# EAGLE schematic ClassD-v3 (EAGLE 7.6.0)
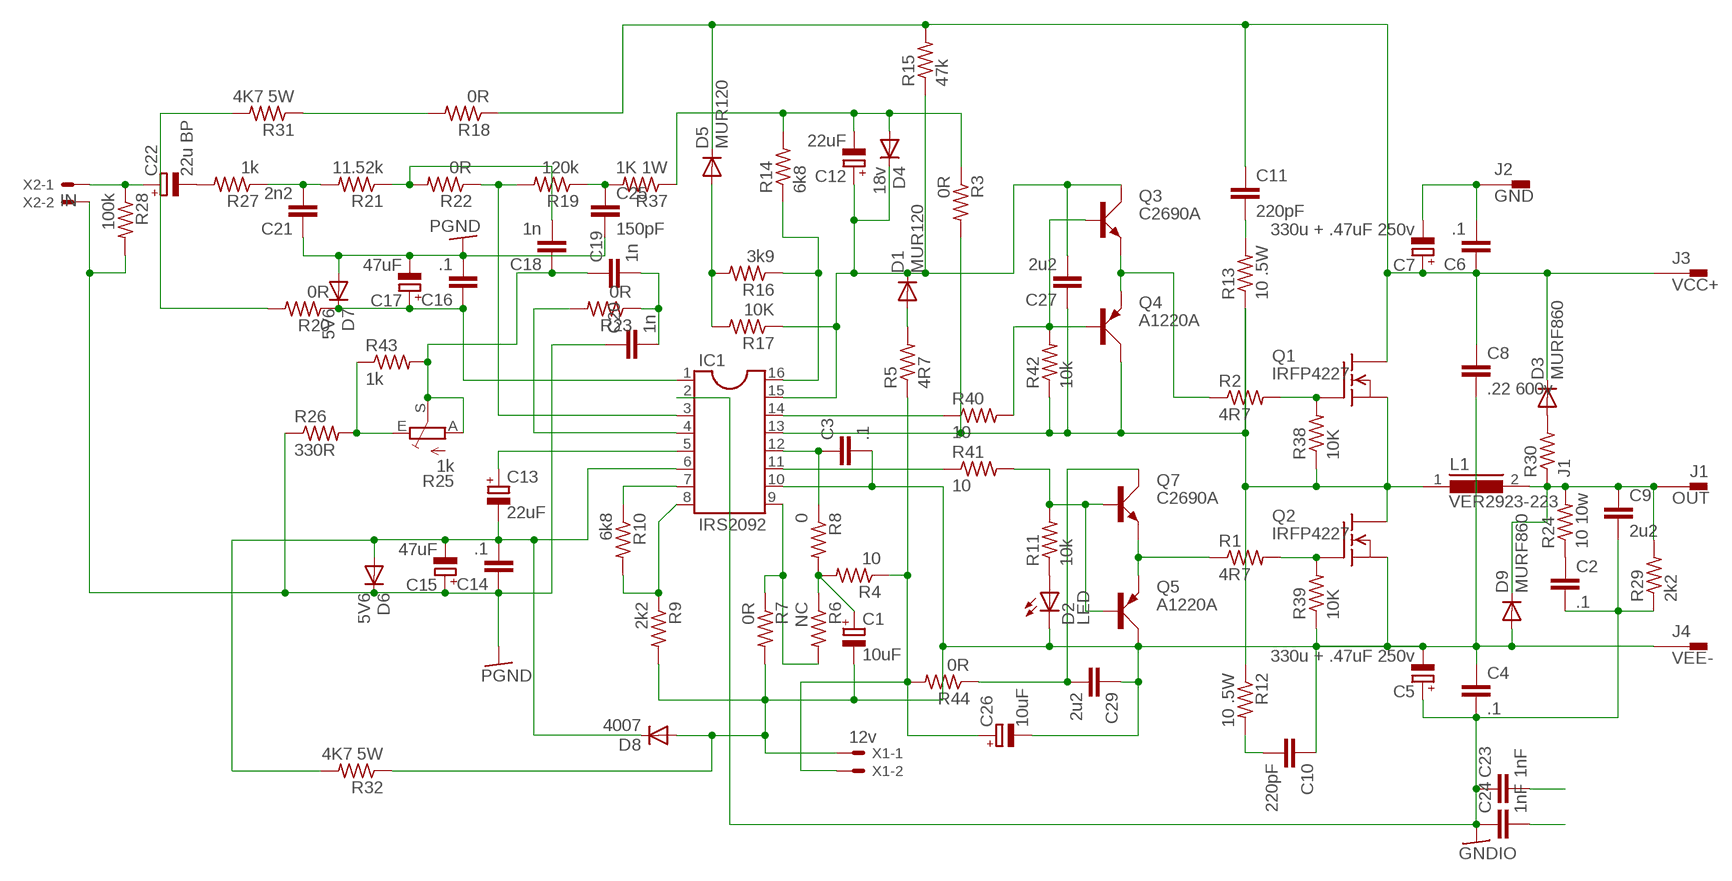
[diagram p0: schematic, sheet 1]

## Parts
C1  10uF  CPOL-EUE2,5-6E  [E2,5-6E]
C2  .1  C15/5  [C15B5]
C3  .1  C-EUC1210  [C1210]
C4  .1  C22/6  [C22.5B6]
C5  330u + .47uF 250v  CPOL-EUE7.5-18  [E7,5-18]
C6  .1  C15/5  [C15B5]
C7  330u + .47uF 250v  CPOL-EUE7.5-18  [E7,5-18]
C8  .22 600v  C22/6  [C22.5B6]
C9  2u2  C27/13  [C27.5B13]
C10  220pF  C5/4.5  [C5B4.5]
C11  220pF  C5/4.5  [C5B4.5]
C12  22uF  CPOL-EUE3.5-8  [E3,5-8]
C13  22uF  CPOL-EUE2.5-6  [E2,5-6]
C14  .1  C-EUC1210K  [C1210K]
C15  47uF  CPOL-EUE2.5-6  [E2,5-6]
C16  .1  C-EUC1210K  [C1210K]
C17  47uF  CPOL-EUE2.5-6  [E2,5-6]
C18  1n  C5/3.5  [C5B3.5]
C19  1n  C5/3.5  [C5B3.5]
C20  1n  C5/3.5  [C5B3.5]
C21  2n2  C5/3.5  [C5B3.5]
C22  22u BP  CPOL-EUE2.5-6  [E2,5-6]
C23  1nF  C7.5/4  [C7.5B4]
C24  1nF  C7.5/4  [C7.5B4]
C25  150pF  C5/4.5  [C5B4.5]
C26  10uF  CPOL-EUE2.5-6  [E2,5-6]
C27  2u2  C-EUC1210K  [C1210K]
C29  2u2  C-EUC1210K  [C1210K]
D1  MUR120  1N4004  [DO41-10]
D2  LED  SFH482  [SFH482]
D3  MURF860  BYT08P  [TO220ACS]
D4  18v  1N4148DO35-7  [DO35-7]
D5  MUR120  1N4148DO35-10  [DO35-10]
D6  5V6  1N4148DO35-10  [DO35-10]
D7  5V6  1N4148DO35-10  [DO35-10]
D8  4007  1N4004  [DO41-10]
D9  MURF860  BYT08P  [TO220ACS]
IC1  IRS2092  DIL16  [DIL16]
J1  OUT  PIN2F061.040  [F061.040]
J2  GND  PIN2F061.040  [F061.040]
J3  VCC+  PIN2F061.040  [F061.040]
J4  VEE-  PIN2F061.040  [F061.040]
L1  VER2923-223  SFT1040  [SFT1040]
Q1  IRFP4227  BUZ347  [TOP3]
Q2  IRFP4227  BUZ347  [TOP3]
Q3  C2690A  BD139  [TO126AV]
Q4  A1220A  BD140  [TO126AV]
Q5  A1220A  BD140  [TO126AV]
Q7  C2690A  BD139  [TO126AV]
R1  4R7  R-US_0207/10  [0207/10]
R2  4R7  R-US_0207/10  [0207/10]
R3  0R  R-US_0207/12  [0207/12]
R4  10  R-US_0207/10  [0207/10]
R5  4R7  R-US_0207/10  [0207/10]
R6  NC  R-US_0204/7  [0204/7]
R7  0R  R-US_0207/10  [0207/10]
R8  0  R-US_0207/10  [0207/10]
R9  2k2  R-US_0207/10  [0207/10]
R10  6k8  R-US_0207/10  [0207/10]
R11  10k  R-US_0207/10  [0207/10]
R12  10 .5W  R-US_0309/12  [0309/12]
R13  10 .5W  R-US_0309/12  [0309/12]
R14  6k8  R-US_0207/10  [0207/10]
R15  47k  R-US_0207/10  [0207/10]
R16  3k9  R-US_0207/10  [0207/10]
R17  10K  R-US_0207/10  [0207/10]
R18  0R  R-US_0207/10  [0207/10]
R19  120k  R-US_0207/12  [0207/12]
R20  0R  R-US_0207/10  [0207/10]
R21  11.52k  R-US_0207/10  [0207/10]
R22  0R  R-US_0207/10  [0207/10]
R23  0R  R-US_0207/10  [0207/10]
R24  10 10w  R-US_0922V  [0922V]
R25  1k  TRIM_EU-B64W  [B64W]
R26  330R  R-US_0207/10  [0207/10]
R27  1k  R-US_0207/10  [0207/10]
R28  100k  R-US_0207/10  [0207/10]
R29  2k2  R-US_0922V  [0922V]
R30  J1  R-US_0207/12  [0207/12]
R31  4K7 5W  R-US_0817/22  [P0817/22]
R32  4K7 5W  R-US_0817/22  [P0817/22]
R37  1K 1W  R-US_0207/10  [0207/10]
R38  10K  R-US_0207/10  [0207/10]
R39  10K  R-US_0207/10  [0207/10]
R40  10  R-US_0207/10  [0207/10]
R41  10  R-US_0204/7  [0204/7]
R42  10k  R-US_0207/10  [0207/10]
R43  1k  R-US_0204/7  [0204/7]
R44  0R  R-US_0207/10  [0207/10]
X1  12v  22-23-2021  [22-23-2021]
X2  IN  22-23-2021  [22-23-2021]

## Nets
COM: C1.- C3.2 C4.1 C5.- C8.2 C10.1 C26.- C29.1 D2.K(C) D8.A D9.A IC1.10 J4.A1 J4.A2 Q2.3(S) Q5.C R7.2 R9.2 R32.1 R39.1 X1.1
N$1: Q1.1(G) R2.2 R38.2
N$3: Q2.1(G) R1.2 R39.2
N$4: IC1.8 R9.1 R10.2
N$5: C6.1 C7.+ C8.1 C11.1 D3.C D5.C J3.A1 J3.A2 Q1.2(D) R15.2 R18.1
N$6: IC1.14 R40.1
N$7: IC1.11 R41.1
N$8: D1.A R5.2
N$9: C2.1 R24.1
N$10: C3.1 IC1.12 R8.1
N$11: C12.+ C27.2 D1.C D4.C IC1.15 Q3.C R15.1 R17.1
N$12: IC1.9 R6.2 R7.1
N$13: C1.+ R4.2 R6.1 R8.2
N$15: C11.2 R13.2
N$16: Q3.E Q4.E R2.1
N$17: R25.E R26.2 R43.1
N$18: C26.+ R4.1 R5.1 R44.2 X1.2
N$19: IC1.7 R10.1
N$21: C10.2 R12.2
N$22: IC1.16 R14.1 R16.1
N$23: D5.A R16.2 R17.2
N$24: C13.+ IC1.5
N$25: C25.1 R19.1 R37.2
N$26: IC1.3 R19.2 R22.1
N$27: C18.1 C19.1 R25.A R25.S R43.2
N$28: C19.2 C20.2 R23.1
N$29: C18.2 R21.1 R22.2
N$30: IC1.4 R23.2
N$31: R18.2 R31.1
N$32: C21.2 R21.2 R27.1
N$33: C22.- R27.2
N$34: C22.+ R28.1 X2.1
N$35: C24.2
N$37: R20.2 R31.2
N$39: C13.- C14.2 C15.- D6.A D8.C IC1.6 R32.2
N$40: C12.- D4.A R3.1 R14.2 R37.1
N$41: C27.1 IC1.13 L1.1 Q1.3(S) Q2.2(D) Q4.C R3.2 R12.1 R13.1 R38.1 R42.1
N$43: Q5.B Q7.B R11.2 R41.2
N$44: Q3.B Q4.B R40.2 R42.2
N$45: C29.2 Q7.C R44.1
N$47: Q5.E Q7.E R1.1
N$49: D2.A R11.1
N$50: C9.1 D9.C J1.A1 J1.A2 L1.2 R24.2 R29.2 R30.1
N$51: D3.A R30.2
N$53: C23.2
PGND: C2.2 C4.2 C5.+ C6.2 C7.- C9.2 C14.1 C15.+ C16.2 C17.- C20.1 C21.1 C23.1 C24.1 C25.2 D6.C D7.A IC1.2 J2.A1 J2.A2 R26.1 R28.2 R29.1 X2.2 ; supply symbol labelled GNDIO
PGND1: C16.1 C17.+ D7.C IC1.1 R20.1

## Library data of the parts
C1 C5 C7 C12 C13 C15 C17 C22 C26 = resistor:CPOL-EU: POLARIZED CAPACITOR, European symbol
C2 C4 C6 C8-C11 C18-C21 C23-C25 = capacitor-wima:C: CAPACITOR naming: grid - package width
C3 C14 C16 C27 C29 = resistor:C-EU: CAPACITOR, European symbol
D1 D8 = diode:1N4004: DIODE general purpose rectifier, 1 A
D2 = led:SFH482: IR LED infrared emitting diode, Infineon
D3 D9 = diode:BYT08P: DIODE ultra fast
D4-D7 = diode:1N4148: DIODE high speed (Philips)
IC1 = ic-package:DIL16: Dual In Line / Socket
J1-J4 = con-faston:PIN2: Flachstecker Typ Tyco/Electronics/AMP TAB, FASTON Printed Circuit Board Tabs Source: http://www.buerklin.com, http://catalog.tycoelectronics.com; OC_FARNELL: unknown; OC_NEWARK: unknown
L1 = inductors:SFT1040: INDUCTOR
Q1 Q2 = transistor-fet:BUZ347: N-Channel Enhancement MOSFET 50V; 40A; 0,030Ohm
Q3 Q7 = transistor-power:BD139: NPN TRANSISTOR
Q4 Q5 = transistor-power:BD140: PNP TRANSISTOR
R1-R24 R26-R32 R37-R44 = resistor:R-US_: RESISTOR, American symbol
R25 = pot:TRIM_EU-: POTENTIOMETER
X1 X2 = con-molex:22-23-2021: .100" (2.54mm) Center Header - 2 Pin; MF: MOLEX; MPN: 22-23-2021; OC_FARNELL: 1462926; OC_NEWARK: 25C3832